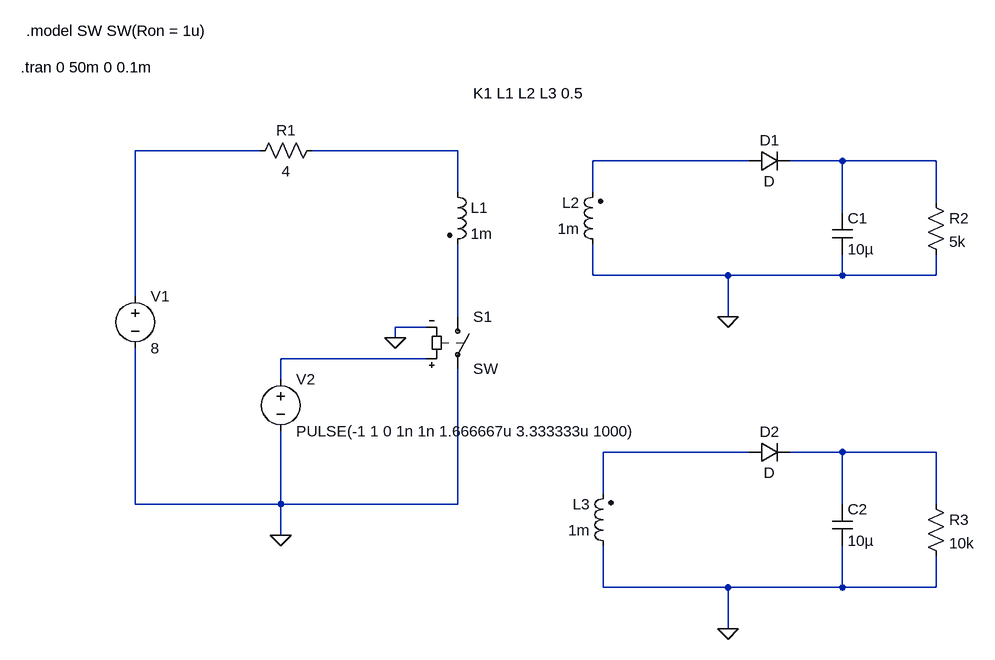
[diagram p0: schematic Forward_Converter.asc]
Forward_Converter.asc, the LTspice schematic file:
Version 4
SHEET 1 1284 680
WIRE 176 -160 -16 -160
WIRE 480 -160 256 -160
WIRE 928 -144 688 -144
WIRE 1072 -144 992 -144
WIRE 1216 -144 1072 -144
WIRE 480 -96 480 -160
WIRE 688 -96 688 -144
WIRE 1216 -80 1216 -144
WIRE 1072 -64 1072 -144
WIRE 688 32 688 -16
WIRE 896 32 688 32
WIRE 1072 32 1072 0
WIRE 1072 32 896 32
WIRE 1216 32 1216 0
WIRE 1216 32 1072 32
WIRE -16 64 -16 -160
WIRE 480 96 480 -16
WIRE 896 96 896 32
WIRE 432 112 384 112
WIRE 384 128 384 112
WIRE 432 160 208 160
WIRE 208 192 208 160
WIRE 928 304 704 304
WIRE 1072 304 992 304
WIRE 1216 304 1072 304
WIRE 704 368 704 304
WIRE -16 384 -16 144
WIRE 208 384 208 272
WIRE 208 384 -16 384
WIRE 480 384 480 176
WIRE 480 384 208 384
WIRE 1072 384 1072 304
WIRE 1216 384 1216 304
WIRE 208 432 208 384
WIRE 704 512 704 448
WIRE 896 512 704 512
WIRE 1072 512 1072 448
WIRE 1072 512 896 512
WIRE 1216 512 1216 464
WIRE 1216 512 1072 512
WIRE 896 576 896 512
FLAG 384 128 0
FLAG 208 432 0
FLAG 896 96 0
FLAG 896 576 0
SYMBOL voltage 208 176 R0
WINDOW 123 0 0 Left 0
WINDOW 39 0 0 Left 0
SYMATTR InstName V2
SYMATTR Value PULSE(-1 1 0 1n 1n 1.666667u 3.333333u 1000)
SYMBOL ind2 464 -112 R0
SYMATTR InstName L1
SYMATTR Value 1m
SYMATTR Type ind
SYMBOL ind2 704 0 R180
WINDOW 0 36 80 Left 2
WINDOW 3 36 40 Left 2
SYMATTR InstName L2
SYMATTR Value 1m
SYMATTR Type ind
SYMBOL ind2 720 464 R180
WINDOW 0 36 80 Left 2
WINDOW 3 36 40 Left 2
SYMATTR InstName L3
SYMATTR Value 1m
SYMATTR Type ind
SYMBOL sw 480 80 R0
SYMATTR InstName S1
SYMBOL diode 928 -128 R270
WINDOW 0 32 32 VTop 2
WINDOW 3 0 32 VBottom 2
SYMATTR InstName D1
SYMBOL diode 928 320 R270
WINDOW 0 32 32 VTop 2
WINDOW 3 0 32 VBottom 2
SYMATTR InstName D2
SYMBOL cap 1056 -64 R0
SYMATTR InstName C1
SYMATTR Value 10µ
SYMBOL cap 1056 384 R0
SYMATTR InstName C2
SYMATTR Value 10µ
SYMBOL res 1200 -96 R0
SYMATTR InstName R2
SYMATTR Value 5k
SYMBOL res 1200 368 R0
SYMATTR InstName R3
SYMATTR Value 10k
SYMBOL res 272 -176 R90
WINDOW 0 0 56 VBottom 2
WINDOW 3 32 56 VTop 2
SYMATTR InstName R1
SYMATTR Value 4
SYMBOL voltage -16 48 R0
WINDOW 123 0 0 Left 0
WINDOW 39 0 0 Left 0
SYMATTR InstName V1
SYMATTR Value 8
TEXT 504 -248 Left 2 !K1 L1 L2 L3 0.5
TEXT -184 -344 Left 2 !.model SW SW(Ron = 1u)
TEXT -192 -288 Left 2 !.tran 0 50m 0 0.1m

The netlist it stands for:
* Forward_Converter.asc
V2 N006 0 PULSE(-1 1 0 1n 1n 1.666667u 3.333333u 1000)
L1 N002 N005 1m
L2 0 N003 1m
L3 0 N007 1m
S1 N005 0 N006 0 SW
D1 N003 N004 D
D2 N007 N008 D
C1 N004 0 10µ
C2 N008 0 10µ
R2 N004 0 5k
R3 N008 0 10k
R1 N002 N001 4
V1 N001 0 8
.model D D
.lib standard.dio
K1 L1 L2 L3 0.5
.model SW SW(Ron = 1u)
.tran 0 50m 0 0.1m
.backanno
.end